# Altium schematic sheet VoltageRegulator.SchDoc
size A4; SheetNumber: 4; SheetTotal: 4
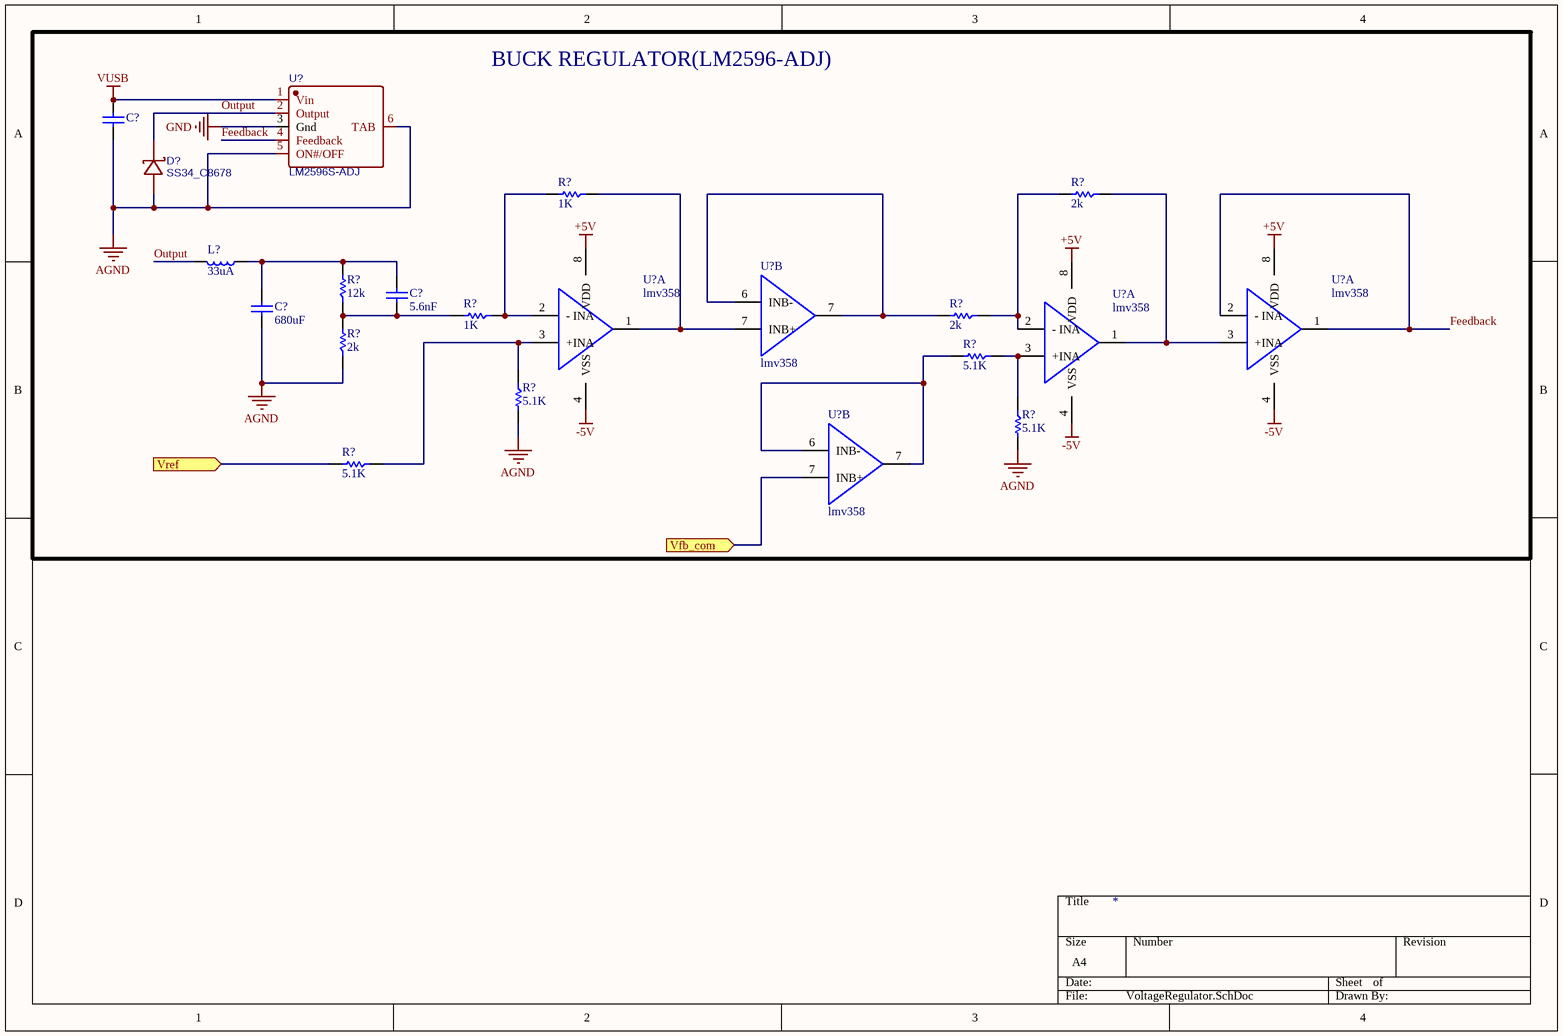
[diagram p0: VoltageRegulator.SchDoc]

## Parts
(Parts that share a designator on the sheet are numbered #1, #2 ... from top to bottom, then left to right.)
C?#1  (no value)  [0805C]
C?#2  680uF  [0805C]
C?#3  5.6nF  [0805C]
D?  SS34_C8678  [DO-214AC_L4.3-W2.7-LS5.3-RD]
L?  33uA  [0805]
R?#1  1K  [0805]
R?#2  2k  [0805]
R?#3  12k  [0805]
R?#4  2k  [0805]
R?#5  1K  [0805]
R?#6  2k  [0805]
R?#7  5.1K  [0805]
R?#8  5.1K  [0805]
R?#9  5.1K  [0805]
R?#10  5.1K  [0805]
U?#1  LM2596S-ADJ  [TO-263-5_L10.2-W8.9-P1.70-BR]
U?#2  lmv358  [SOP-8_L4.9-W3.9-P1.27-LS6.0-BL]  (part B of 2)
U?#3  lmv358  [SOP-8_L4.9-W3.9-P1.27-LS6.0-BL]  (part A of 2)
U?#4  lmv358  [SOP-8_L4.9-W3.9-P1.27-LS6.0-BL]  (part A of 2)
U?#5  lmv358  [SOP-8_L4.9-W3.9-P1.27-LS6.0-BL]  (part A of 2)
U?#6  lmv358  [SOP-8_L4.9-W3.9-P1.27-LS6.0-BL]  (part B of 2)

## Blocks framed on the sheet
BUCK REGULATOR(LM2596-ADJ): C?#1-C?#3 D? L? R?#1-R?#10 U?#1-U?#6

## Ports
Vfb_com (in), Vref (in)

## Nets
+5V: U?#3.8(VDD) U?#4.8(VDD) U?#5.8(VDD)
-5V: U?#3.4(VSS) U?#4.4(VSS) U?#5.4(VSS)
AGND: C?#1.2 C?#2.1 D?.2(A) R?#4.1 R?#8.2 R?#9.2 U?#1.5(ON#/OFF) U?#1.6(TAB)
GND: U?#1.3(Gnd)
VUSB: C?#1.1 U?#1.1(Vin)
Feedback: U?#1.4(Feedback) U?#4.1(OUTA) U?#4.2(-_INA)
Output: D?.1(K) L?.2 U?#1.2(Output)
Vfb_com: U?#6.7(INB+) ; port Vfb_com
Vref: R?#10.2 ; port Vref
NetC?#2_2: C?#2.2 C?#3.1 L?.1 R?#3.2
NetC?#3_2: C?#3.2 R?#3.1 R?#4.2 R?#5.2
NetR?#1_1: R?#1.1 U?#2.7(INB+) U?#3.1(OUTA)
NetR?#1_2: R?#1.2 R?#5.1 U?#3.2(-_INA)
NetR?#2_1: R?#2.1 U?#4.3(+INA) U?#5.1(OUTA)
NetR?#2_2: R?#2.2 R?#6.1 U?#5.2(-_INA)
NetR?#6_2: R?#6.2 U?#2.6(INB-) U?#2.7(OUTB)
NetR?#7_1: R?#7.1 R?#9.1 U?#5.3(+INA)
NetR?#7_2: R?#7.2 U?#6.6(INB-) U?#6.7(OUTB)
NetR?#8_1: R?#8.1 R?#10.1 U?#3.3(+INA)

## Library data of the parts
C?#1 = C_10: Capacitor; Reviewed by: RM - 2018/08/05; Revision: July-2002: Re-released for DXP Platform.; Supplier 1: *; Supplier Part Number 1: *
C?#2 = C_11: Capacitor; Reviewed by: RM - 2018/08/05; Revision: July-2002: Re-released for DXP Platform.; Supplier 1: *; Supplier Part Number 1: *; Value: 680uF
C?#3 = C_7: Capacitor; Reviewed by: RM - 2018/08/05; Revision: July-2002: Re-released for DXP Platform.; Supplier 1: *; Supplier Part Number 1: *; Value: 5.6nF
D? = SS34_C8678: BOM_Manufacturer Part: SS34; BOM_Manufacturer: MDD; BOM_Supplier: LCSC; BOM_Supplier Part: C8678; BOM_JLCPCB Part Class: Basic Part; spicePre: D; spiceSymbolName: SS34_C8678
L? = I: Inductor; Reviewed by: RM - 2018/08/05; Supplier 1: *; Supplier Part Number 1: *; Value: 33uA
R?#1 R?#5 = R_6: Resistor; Reviewed by: RM - 2018/08/05; Supplier 1: *; Suppler Part Number 1: *; Value: 1K
R?#2 R?#4 R?#6 = R_3: Resistor; Reviewed by: RM - 2018/08/05; Supplier 1: *; Suppler Part Number 1: *; Value: 2k
R?#3 = R_2: Resistor; Reviewed by: RM - 2018/08/05; Supplier 1: *; Suppler Part Number 1: *; Value: 12k
R?#7-R?#10 = R_1: Resistor; Reviewed by: RM - 2018/08/05; Supplier 1: *; Suppler Part Number 1: *; Value: 5.1K
U?#1 = LM2596S-ADJ: BOM_Manufacturer: UMW(Youtai Semiconductor Co., Ltd.); Contributor: LCSC; BOM_Supplier: LCSC; BOM_Supplier Part: C347423; BOM_Manufacturer Part: LM2596S-ADJ; BOM_JLCPCB Part Class: Extended Part; spicePre: U; spiceSymbolName: LM2596S-ADJ
U?#2-U?#6 = LMV358-SR: OpAmp High Frequency Dual; Reviewed by: RM - 2018/08/05